# Altium schematic sheet Sheet_1.SchDoc
size A4; SheetNumber: 3; SheetTotal: 3
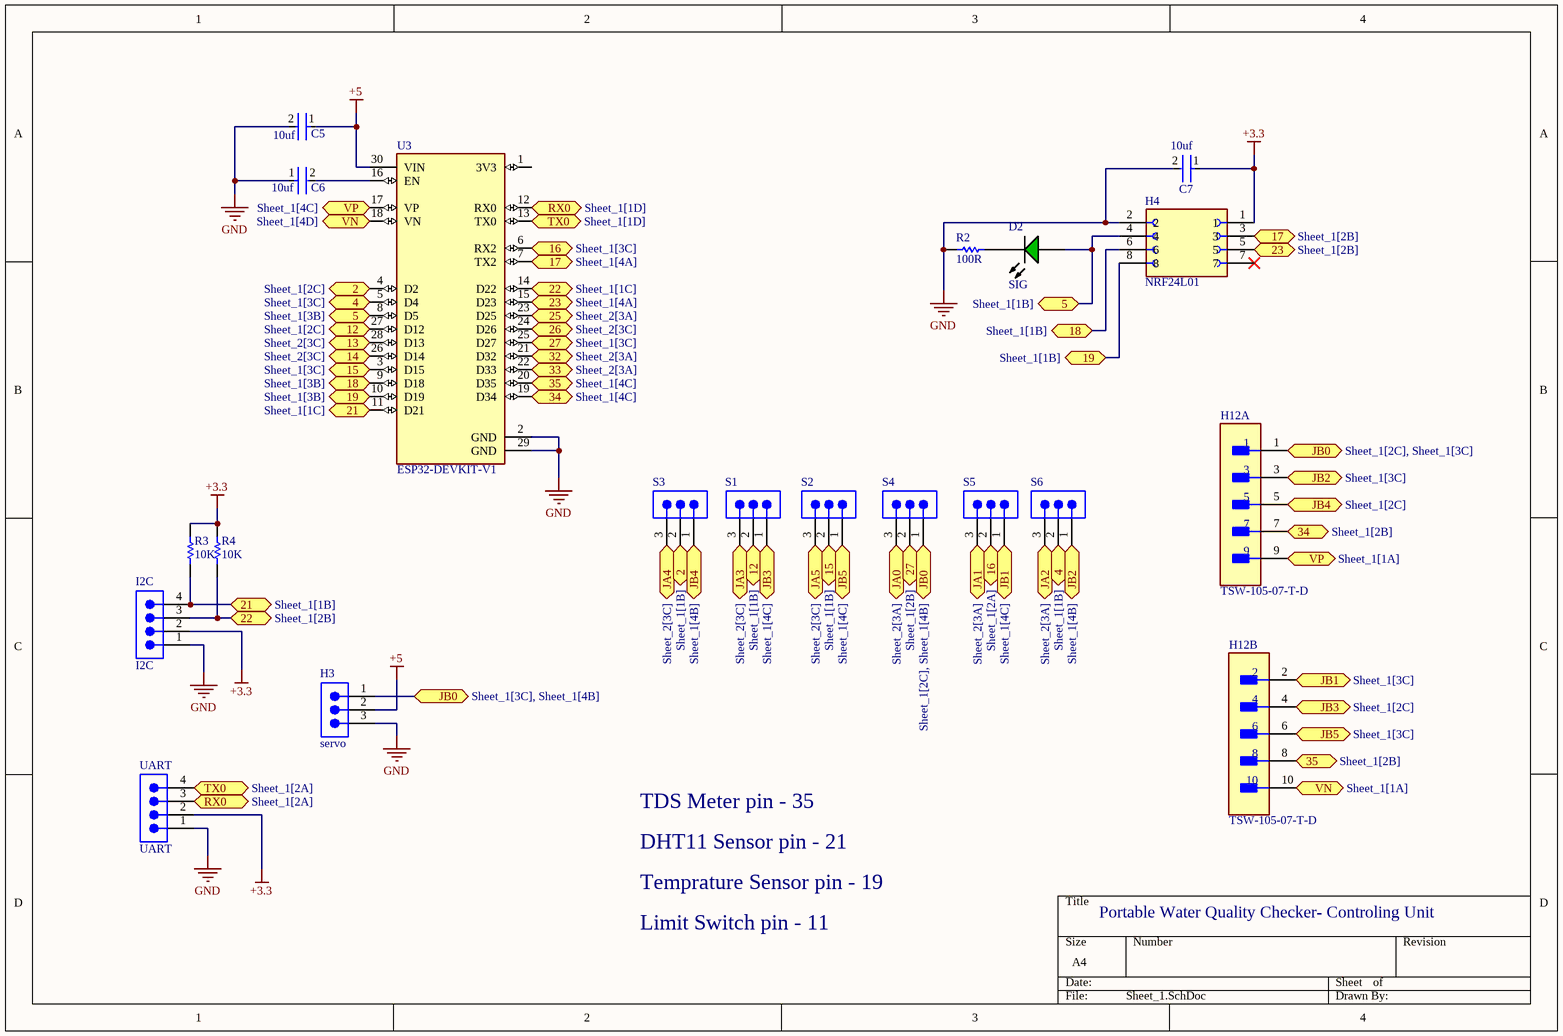
[diagram p0: Sheet_1.SchDoc]

## Parts
C5  10uf  [FP-GRM21B-0_1-MFG]
C6  10uf  [FP-GRM21B-0_1-MFG]
C7  10uf  [FP-GRM21B-0_1-MFG]
D2  SIG  [AVAG-HSMX-C170_V]
H3  servo  [SMTC-TSW-103-07-X-S]
H4  NRF24L01  [SULLINS_PPPC042LFBN-RC]
H12  TSW-105-07-T-D  [FP-TSW-105-07-T-D-MFG]  (parts A,B of 2)
I2C  I2C  [61300411121]
R2  100R  [RESC2013X70X40NL20T20]
R3  10K  [RESC2013X70X40NL20T20]
R4  10K  [RESC2013X70X40NL20T20]
S1  TSW-103-07-F-S  [SMTC-TSW-103-07-X-S]  (value not drawn)
S2  TSW-103-07-F-S  [SMTC-TSW-103-07-X-S]  (value not drawn)
S3  TSW-103-07-F-S  [SMTC-TSW-103-07-X-S]  (value not drawn)
S4  TSW-103-07-F-S  [SMTC-TSW-103-07-X-S]  (value not drawn)
S5  TSW-103-07-F-S  [SMTC-TSW-103-07-X-S]  (value not drawn)
S6  TSW-103-07-F-S  [SMTC-TSW-103-07-X-S]  (value not drawn)
U3  ESP32-DEVKIT-V1  [MODULE_ESP32_DEVKIT_V1]
UART  UART  [61300411121]

## Ports
2 (bidir, see Sheet_1[1B]), 2 (bidir, see Sheet_1[2C]), 4 (bidir, see Sheet_1[1B]), 4 (bidir, see Sheet_1[3C]), 5 (bidir, see Sheet_1[1B]), 5 (bidir, see Sheet_1[3B]), 12 (bidir, see Sheet_1[1B]), 12 (bidir, see Sheet_1[2C]), 13 (bidir, see Sheet_2[3C]), 14 (bidir, see Sheet_2[3C]), 15 (bidir, see Sheet_1[1B]), 15 (bidir, see Sheet_1[3C]), 16 (bidir, see Sheet_1[2A]), 16 (bidir, see Sheet_1[3C]), 17 (bidir, see Sheet_1[2B]), 17 (bidir, see Sheet_1[4A]), 18 (bidir, see Sheet_1[1B]), 18 (bidir, see Sheet_1[3B]), 19 (bidir, see Sheet_1[1B]), 19 (bidir, see Sheet_1[3B]), 21 (bidir, see Sheet_1[1B]), 21 (bidir, see Sheet_1[1C]), 22 (bidir, see Sheet_1[1C]), 22 (bidir, see Sheet_1[2B]), 23 (bidir, see Sheet_1[2B]), 23 (bidir, see Sheet_1[4A]), 25 (bidir, see Sheet_2[3A]), 26 (bidir, see Sheet_2[3C]), 27 (bidir, see Sheet_1[2B]), 27 (bidir, see Sheet_1[3C]), 32 (bidir, see Sheet_2[3A]), 33 (bidir, see Sheet_2[3A]), 34 (bidir, see Sheet_1[2B]), 34 (bidir, see Sheet_1[4C]), 35 (bidir, see Sheet_1[2B]), 35 (bidir, see Sheet_1[4C]), JA0 (bidir, see Sheet_2[3A]), JA1 (bidir, see Sheet_2[3A]), JA2 (bidir, see Sheet_2[3A]), JA3 (bidir, see Sheet_2[3C]), JA4 (bidir, see Sheet_2[3C]), JA5 (bidir, see Sheet_2[3C]), JB0 (bidir, see Sheet_1[2C], Sheet_1[3C]), JB0 (bidir, see Sheet_1[2C], Sheet_1[4B]), JB0 (bidir, see Sheet_1[3C], Sheet_1[4B]), JB1 (bidir, see Sheet_1[3C]), JB1 (bidir, see Sheet_1[4C]), JB2 (bidir, see Sheet_1[3C]), JB2 (bidir, see Sheet_1[4B]), JB3 (bidir, see Sheet_1[2C]), JB3 (bidir, see Sheet_1[4C]), JB4 (bidir, see Sheet_1[2C]), JB4 (bidir, see Sheet_1[4B]), JB5 (bidir, see Sheet_1[3C]), JB5 (bidir, see Sheet_1[4C]), RX0 (bidir, see Sheet_1[1D]), RX0 (bidir, see Sheet_1[2A]), TX0 (bidir, see Sheet_1[1D]), TX0 (bidir, see Sheet_1[2A]), VN (bidir, see Sheet_1[1A]), VN (bidir, see Sheet_1[4D]), VP (bidir, see Sheet_1[1A]), VP (bidir, see Sheet_1[4C])

## Nets
+3.3: C7.1 H4.1 I2C.2 R3.2 R4.2 UART.2
+5: C5.1 H3.2 U3.30(VIN)
GND: C5.2 C6.1 C7.2 H3.3 H4.2 I2C.1 R2.1 U3.2(GND) U3.29(GND) UART.1
2: S3.2 U3.4(D2) ; port 2
4: S6.2 U3.5(D4) ; port 4
5: D2.1(A) H4.4 U3.8(D5) ; port 5
12: S1.2 U3.27(D12) ; port 12
13: U3.28(D13) ; port 13
14: U3.26(D14) ; port 14
15: S2.2 U3.3(D15) ; port 15
16: S5.2 U3.6(RX2) ; port 16
17: H4.3 U3.7(TX2) ; port 17
18: H4.6 U3.9(D18) ; port 18
19: H4.8 U3.10(D19) ; port 19
21: I2C.4 R3.1 U3.11(D21) ; port 21
22: I2C.3 R4.1 U3.14(D22) ; port 22
23: H4.5 U3.15(D23) ; port 23
25: U3.23(D25) ; port 25
26: U3.24(D26) ; port 26
27: S4.2 U3.25(D27) ; port 27
32: U3.21(D32) ; port 32
33: U3.22(D33) ; port 33
34: H12.7 U3.19(D34) ; port 34
35: H12.8 U3.20(D35) ; port 35
JA0: S4.3 ; port JA0
JA1: S5.3 ; port JA1
JA2: S6.3 ; port JA2
JA3: S1.3 ; port JA3
JA4: S3.3 ; port JA4
JA5: S2.3 ; port JA5
JB0: H3.1 H12.1 S4.1 ; port JB0
JB1: H12.2 S5.1 ; port JB1
JB2: H12.3 S6.1 ; port JB2
JB3: H12.4 S1.1 ; port JB3
JB4: H12.5 S3.1 ; port JB4
JB5: H12.6 S2.1 ; port JB5
RX0: U3.12(RX0) UART.3 ; port RX0
TX0: U3.13(TX0) UART.4 ; port TX0
VN: H12.10 U3.18(VN) ; port VN
VP: H12.9 U3.17(VP) ; port VP
NetC6_2: C6.2 U3.16(EN)
NetD2_2: D2.2(K) R2.2

Not connected (* = marked no-connect by the designer): H4 7*; U3 1(3V3)

## Notes on the sheet
- TDS Meter pin - 35
- DHT11 Sensor pin - 21
- Temprature Sensor pin - 19
- Portable Water Quality Checker- Controling Unit
- Limit Switch pin - 11

## Library data of the parts
C5-C7 = CMP-2007-03453-2: Chip Multilayer Ceramic Capacitors for General Purpose, 0805, 10uF, X5R, 15%, 10%, 16V; Radiation Hardening: No; Thickness: 0.053inch; Voltage Rating (DC): 16V; Lead Free: Lead Free; Package Quantity: 1; Width: 1.25mm; Case Code (Imperial): 0805; Depth: 1.25mm; Packaging: Tape and Reel; Dielectric: X5R; Max Operating Temperature: 85°C; Tolerance: 10%; Voltage Rating: 16V; Voltage: 16V; Capacitance: 10uF; Height: 1.25mm; Case Code (Metric): 2012; Material: Ceramic; Mount: Surface Mount; Case/Package: 0805; REACH SVHC: No SVHC; Length: 2mm; Min Operating Temperature: -55°C; Termination: SMD/SMT
D2 = CMP-2000-05062-1: Chip LED, Green, 2.2 V, -40 to 85 degC, 2-Pin SMD, Pb-Free, Tape and Reel; Manufacturer: Avago; No. of Pins: 2; Peak Wavelength: 570nm; SVHC: NoSVHC(16-Jun-2014); Dominant Wavelength: 572nm; Forward Current If: 20mA; Viewing Angle: 170deg; Lens Shape: Rectangular; PIV Max: 5V; External Width: 1.25mm; LED Type: Standard; External Depth: 0.8mm; Opto Mounting Orientation: Top; Luminous Intensity: 15mcd; Luminous Intensity Min: 4mcd; Forward Voltage VF Max: 2.6V; External Length / Height: 2mm; Bulb Size: 1.25mmx1.4mm; Light Area Height: 1mm; Voltage Vf Typ: 2.2V; Operating Temperature Max: 85degC; Datasheet Version: Oct-08; MSL: MSL2A-4weeks; Peak Forward Current: 20mA; Package Description: 2-Pin Surface Mount Device, Body 2 x 1.25 mm, Height 0.8 mm; Datasheet URL: https://datasheet.ciiva.com/29280/180495-da-01-en-chip-led-hsmg-c170-gelb-gruen-29280971.pdf; Storage Temperature Min: -40degC; LED Colour: Green; Wavelength Typ: 570nm; Mounting Type: SMD; Forward Current If Max: 20mA; Dominant Wavelength Typ: 572nm; LED Mounting: SMD; Operating Temperature Range: -30degCto+85degC; Operating Temperature Min: -30degC; Manufacturer URL: http://www.avagotech.com/; Packaging: CutTape; Luminous Intensity Typ: 15mcd; Package Reference: HSMX-C170; Storage Temperature Max: 85degC; Opto Case Style: SMD; Forward Voltage: 2.2V
H3 = CMP-1024-00331-1: 0.025" SQ Post Header, Through-hole, Vertical, -55 to 125 degC, 2.54 mm Pitch, 3-Pin, Male, RoHS; Manufacturer: Samtec; PartNumber: TSW-103-07-F-S; Pitch: 2.54 mm; DatasheetVersion: F-214; ComponentLink1Description: Manufacturer URL; ComponentLink3URL: http://www.samtec.com/documents/webfiles/cpdf/TSW-XXX-XX-XXX-X-XX-XXX-MKT.pdf; Mounting Technology: Through-hole; PackageDescription: .025[0.64] SQ. Post Terminal Strip Assembly; Temperature Range: -55 to 125 degC; ComponentLink3Description: Package Specification; Orientation: Vertical; RoHS: True; PackageVersion: DM, 8/1988; ComponentLink2Description: Datasheet; ComponentLink1URL: http://www.samtec.com; ComponentLink2URL: http://www.samtec.com/documents/webfiles/pdf/TSW_TH.PDF; PackageReference: TSW-103-07-X-S
H4 = PPPC042LFBN-RC: 8 Position Total Dual Row 2.54 mm Pitch Straight Female Header; MF: Sullins Connector Solutions; MP: PPPC042LFBNRC; SnapEDA_Link: https://www.snapeda.com/parts/PPPC042LFBNRC/Sullins/view-part/?ref=snap; Package: None; Value: *; Check_prices: https://www.snapeda.com/parts/PPPC042LFBNRC/Sullins/view-part/?ref=eda
H12 = CMP-00575-00272450-1: TSW-105-07-T-D Conn Unshrouded Header HDR 10 POS 2.54mm Solder ST Thru-Hole Automotive Bulk; NexarPartId: 272450; Manufacturer Lifecycle Status: PRODUCTION; Gender: Male; Number of Contacts: 10; Max Current Rating: 7.6A; Connector Type: Male Pin; Max Voltage Rating (AC): 550V; Row Spacing: 2.54mm; Packaging: Bulk; Number of Positions: 10; Color: Black; Lead Pitch: 2.54mm; Width: 5.08mm; Number of Rows: 2; Max Operating Temperature: 105°C; Radiation Hardening: No; Min Operating Temperature: -55°C; Lifecycle Status: Production; Lead Free: Lead Free; Orientation: Straight; RoHS: Compliant; REACH SVHC: No SVHC; Contact Material: Bronze, Nickel, Tin; Height: 8.71mm; Pitch: 2.54mm; Housing Color: Black; Length: 12.7mm; Depth: 5.08mm; Termination: Solder; Contact Plating: Tin; Number of Pins: 10; Housing Material: Polyester; Mount: Through Hole; Contact Mating Length: 5.842mm
I2C UART = CMP-1502-01064-3: NexarPartId: 32855522; Operating Supply Voltage: 250V; Pitch: 2.54mm; Contact Resistance: 20mΩ; Number of Positions: 4; Current Rating: 3A; Connector Type: Male Pin; Gender: Male; Contact Plating: Gold; Height: 8.89mm; Lead Pitch: 2.54mm; Lead Free: Lead Free; Contact Mating Length: 5.9944mm; Number of Rows: 1; Termination: Solder; Packaging: Bulk; REACH SVHC: Unknown; Min Operating Temperature: -40°C; RoHS: Compliant; Number of Contacts: 4; Voltage Rating: 250V; Color: Black; Max Operating Temperature: 105°C; Contact Material: Copper; Mount: Through Hole; Orientation: Vertical; Number of Pins: 4
R2 = CMP-2001-00532-1: Manufacturer: Panasonic; Part Number: ERJ6ENF3300V
R3 R4 = CMP-2001-04376-1: Manufacturer: Panasonic; Part Number: ERJ-6ENF1002V
S1-S6 = CMP-1024-00331-1: 0.025" SQ Post Header, Through-hole, Vertical, -55 to 125 degC, 2.54 mm Pitch, 3-Pin, Male, RoHS; Manufacturer: Samtec; Pitch: 2.54 mm; DatasheetVersion: F-214; ComponentLink1Description: Manufacturer URL; ComponentLink3URL: http://www.samtec.com/documents/webfiles/cpdf/TSW-XXX-XX-XXX-X-XX-XXX-MKT.pdf; Mounting Technology: Through-hole; PackageDescription: .025[0.64] SQ. Post Terminal Strip Assembly; Temperature Range: -55 to 125 degC; ComponentLink3Description: Package Specification; Orientation: Vertical; PartNumber: TSW-103-07-F-S; RoHS: True; PackageVersion: DM, 8/1988; ComponentLink2Description: Datasheet; ComponentLink1URL: http://www.samtec.com; ComponentLink2URL: http://www.samtec.com/documents/webfiles/pdf/TSW_TH.PDF; PackageReference: TSW-103-07-X-S
U3 = ESP32-DEVKIT-V1: Dual core, Wi-Fi: 2.4 GHz up to 150 Mbits/s,BLE (Bluetooth Low Energy) and legacy Bluetooth, 32 bits, Up to 240 MHz; MF: Do it; SnapEDA_Link: https://www.snapeda.com/parts/ESP32-DEVKIT-V1/Do+it/view-part/?ref=snap; Package: None; Value: *; MP: ESP32-DEVKIT-V1; Check_prices: https://www.snapeda.com/parts/ESP32-DEVKIT-V1/Do+it/view-part/?ref=eda